# EAGLE design mesinCuciTangan (EAGLE 9.6.2)
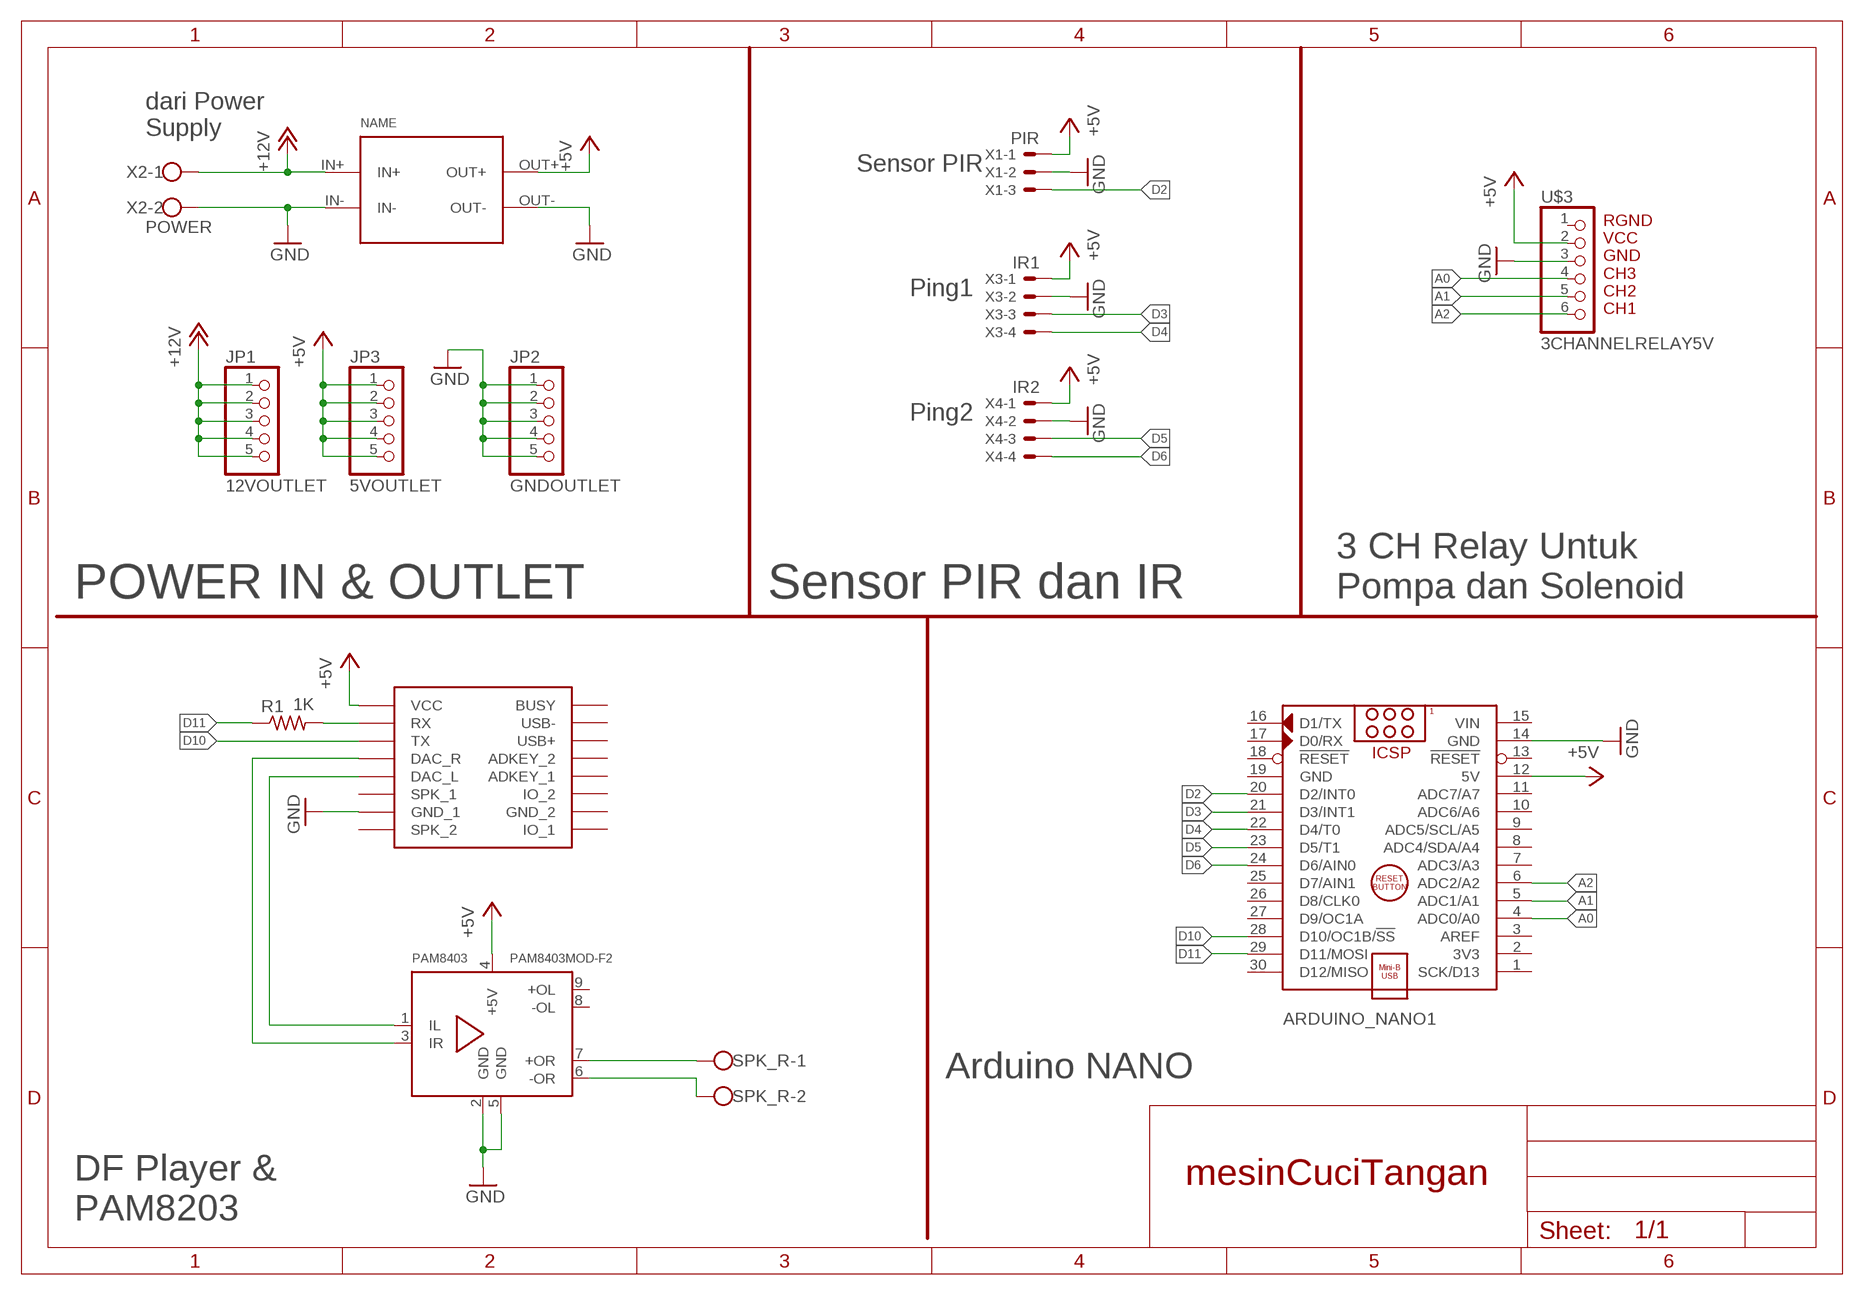
[diagram p0: schematic, sheet 1]

## Parts
ARDUINO_NANO1  ARDUINO_NANO  [ARDUINO_NANO]
JP1  12VOUTLET  PINHD-1X5  [1X05]
JP2  GNDOUTLET  PINHD-1X5  [1X05]
JP3  5VOUTLET  PINHD-1X5  [1X05]
LM2596  LM2596  CP8-ADJ  [CP8-ADJ]
PAM8403  PAM8403MOD-F2  [PAM8403MOD2]
R1  1K  R-US_0207/10  [0207/10]
SPK_R  W237-102  [W237-102]
U$2  DFPLAYER  [DFPLAYER]
U$3  3CHANNELRELAY5V  [3CHANNELRELAY]
X1  PIR  22-23-2031  [22-23-2031]
X2  POWER  W237-102  [W237-102]
X3  IR1  22-23-2041  [22-23-2041]
X4  IR2  22-23-2041  [22-23-2041]

## Nets
+5V: ARDUINO_NANO1.12(5V) JP3.1 JP3.2 JP3.3 JP3.4 JP3.5 LM2596.OUT+ PAM8403.4(+5V) U$2.VCC U$3.2 X1.1 X3.1 X4.1
+12V: JP1.1 JP1.2 JP1.3 JP1.4 JP1.5 LM2596.IN+ X2.1
A0: ARDUINO_NANO1.4(ADC0/A0) U$3.4
A1: ARDUINO_NANO1.5(ADC1/A1) U$3.5
A2: ARDUINO_NANO1.6(ADC2/A2) U$3.6
D2: ARDUINO_NANO1.20(D2/INT0) X1.3
D3: ARDUINO_NANO1.21(D3/INT1) X3.3
D4: ARDUINO_NANO1.22(D4/T0) X3.4
D5: ARDUINO_NANO1.23(D5/T1) X4.3
D6: ARDUINO_NANO1.24(D6/AIN0) X4.4
D10: ARDUINO_NANO1.28(D10/OC1B/!SS) U$2.TX
D11: ARDUINO_NANO1.29(D11/MOSI) R1.1
GND: ARDUINO_NANO1.14(GND) JP2.1 JP2.2 JP2.3 JP2.4 JP2.5 LM2596.IN- LM2596.OUT- PAM8403.2(GND) PAM8403.5(GND) U$2.GND_1 U$3.3 X1.2 X2.2 X3.2 X4.2
N$1: PAM8403.7(+OR) SPK_R.1
N$2: PAM8403.1(IL) U$2.DAC_L
N$3: PAM8403.3(IR) U$2.DAC_R
N$4: PAM8403.6(-OR) SPK_R.2
N$7: R1.2 U$2.RX
Unconnected: ARDUINO_NANO1.1(SCK/D13) ARDUINO_NANO1.2(3V3) ARDUINO_NANO1.3(AREF) ARDUINO_NANO1.7(ADC3/A3) ARDUINO_NANO1.8(ADC4/SDA/A4) ARDUINO_NANO1.9(ADC5/SCL/A5) ARDUINO_NANO1.10(ADC6/A6) ARDUINO_NANO1.11(ADC7/A7) ARDUINO_NANO1.13(!RESET) ARDUINO_NANO1.16(D1/TX) ARDUINO_NANO1.17(D0/RX) ARDUINO_NANO1.18(!RESET) ARDUINO_NANO1.25(D7/AIN1) ARDUINO_NANO1.26(D8/CLK0) ARDUINO_NANO1.27(D9/OC1A) ARDUINO_NANO1.30(D12/MISO) PAM8403.8(-OL) PAM8403.9(+OL) U$2.ADKEY1(ADKEY_1) U$2.ADKEY2(ADKEY_2) U$2.BUSY U$2.GND_2 U$2.IO1(IO_1) U$2.IO2(IO_2) U$2.SPK1(SPK_1) U$2.SPK2(SPK_2) U$2.USB+ U$2.USB- U$3.1

## Notes on the sheet
- dari Power
  Supply
- Sensor PIR
- Ping1
- Ping2
- POWER IN & OUTLET | Sensor PIR dan IR
- 3 CH Relay Untuk 
  Pompa dan Solenoid
- Arduino NANO
- DF Player &
  PAM8203

## Power pins joined to a net without a drawn wire
GND: ARDUINO_NANO1.19(GND)
VIN: ARDUINO_NANO1.15(VIN)

## Library data of the parts
ARDUINO_NANO1 = ArduinoNanoV30:ARDUINO_NANO: Arduino Nano V3.0 Module Overview: The Arduino Nano is a small, complete, and breadboard-friendly board based on the ATmega328 (Arduino Nano 3.x) or ATmega168 (Arduino Nano 2.x). It has more or less the same functionality of the Arduino Duemilanove, but in a different package. It lacks only a DC power jack, and works with a Mini-B USB cable instead of a standard one. The Nano was designed and is being produced by Gravitech <http://www.gravitech.us/arna30wiatp.html>. General specifications: Item Value Microcontroller Atmel ATmega168 or ATmega328 Operating Voltage (logic level) 5 V Input Voltage (recommended) 7-12 V Input Voltage (limits) 6-20 V Digital I/O Pins 14 (of which 6 provide PWM output) Analog Input Pins 8 DC Current per I/O Pin 40 mA Flash Memory 16 KB (ATmega168) or 32 KB (ATmega328) of which 2 KB used by bootloader SRAM 1 KB (ATmega168) or 2 KB (ATmega328) EEPROM 512 bytes (ATmega168) or 1 KB (ATmega328) Clock Speed 16 MHz Dimensions (Inches) 0.73" x 1.70" Dimensions (mm) 18mm x 45mm Overall height About 9 mm (not including pins) Weigth 5 g Power: The Arduino Nano can be powered via the Mini-B USB connection, 6-20V unregulated external power supply (pin 30), or 5V regulated external power supply (pin 27). The power source is automatically selected to the highest voltage source. Memory: The ATmega168 has 16 KB of flash memory for storing code (of which 2 KB is used for the bootloader); the ATmega328 has 32 KB, (also with 2 KB used for the bootloader). The ATmega168 has 1 KB of SRAM and 512 bytes of EEPROM (which can be read and written with the EEPROM library); the ATmega328 has 2 KB of SRAM and 1 KB of EEPROM. Input and Output: Each of the 14 digital pins on the Nano can be used as an input or output, using pinMode(), digitalWrite(), and digitalRead() functions. They operate at 5 volts. Each pin can provide or receive a maximum of 40 mA and has an internal pull-up resistor (disconnected by default) of 20-50 kOhms. In addition, some pins have specialized functions. Visit Arduino - ArduinoBoardNano <https://www.arduino.cc/en/Main/ArduinoBoardNano>
JP1-JP3 = pinhead:PINHD-1X5: PIN HEADER
LM2596 = userlib:CP8-ADJ: Voltage regulator IN: 7-35V OUT: ADJ
PAM8403 = dl9sec_public:PAM8403MOD: PAM8403 module 2x3W@4R
R1 = rcl:R-US_: RESISTOR, American symbol; SPICEPREFIX: R
SPK_R X2 = con-wago-500:W237-102: WAGO SCREW CLAMP; MPN: 237-102; OC_FARNELL: unknown; OC_NEWARK: 70K9898
U$2 = DFPlayer_v1:DFPLAYER
U$3 = mesinCuciCustomLib:3CHANNELRELAY5V
X1 = con-molex:22-23-2031: .100" (2.54mm) Center Header - 3 Pin; MF: MOLEX; MPN: 22-23-2031; OC_FARNELL: 1462950; OC_NEWARK: 30C0862
X3 X4 = con-molex:22-23-2041: .100" (2.54mm) Center Header - 4 Pin; MF: MOLEX; MPN: 22-23-2041; OC_FARNELL: 1462920; OC_NEWARK: 38C0355

## Board
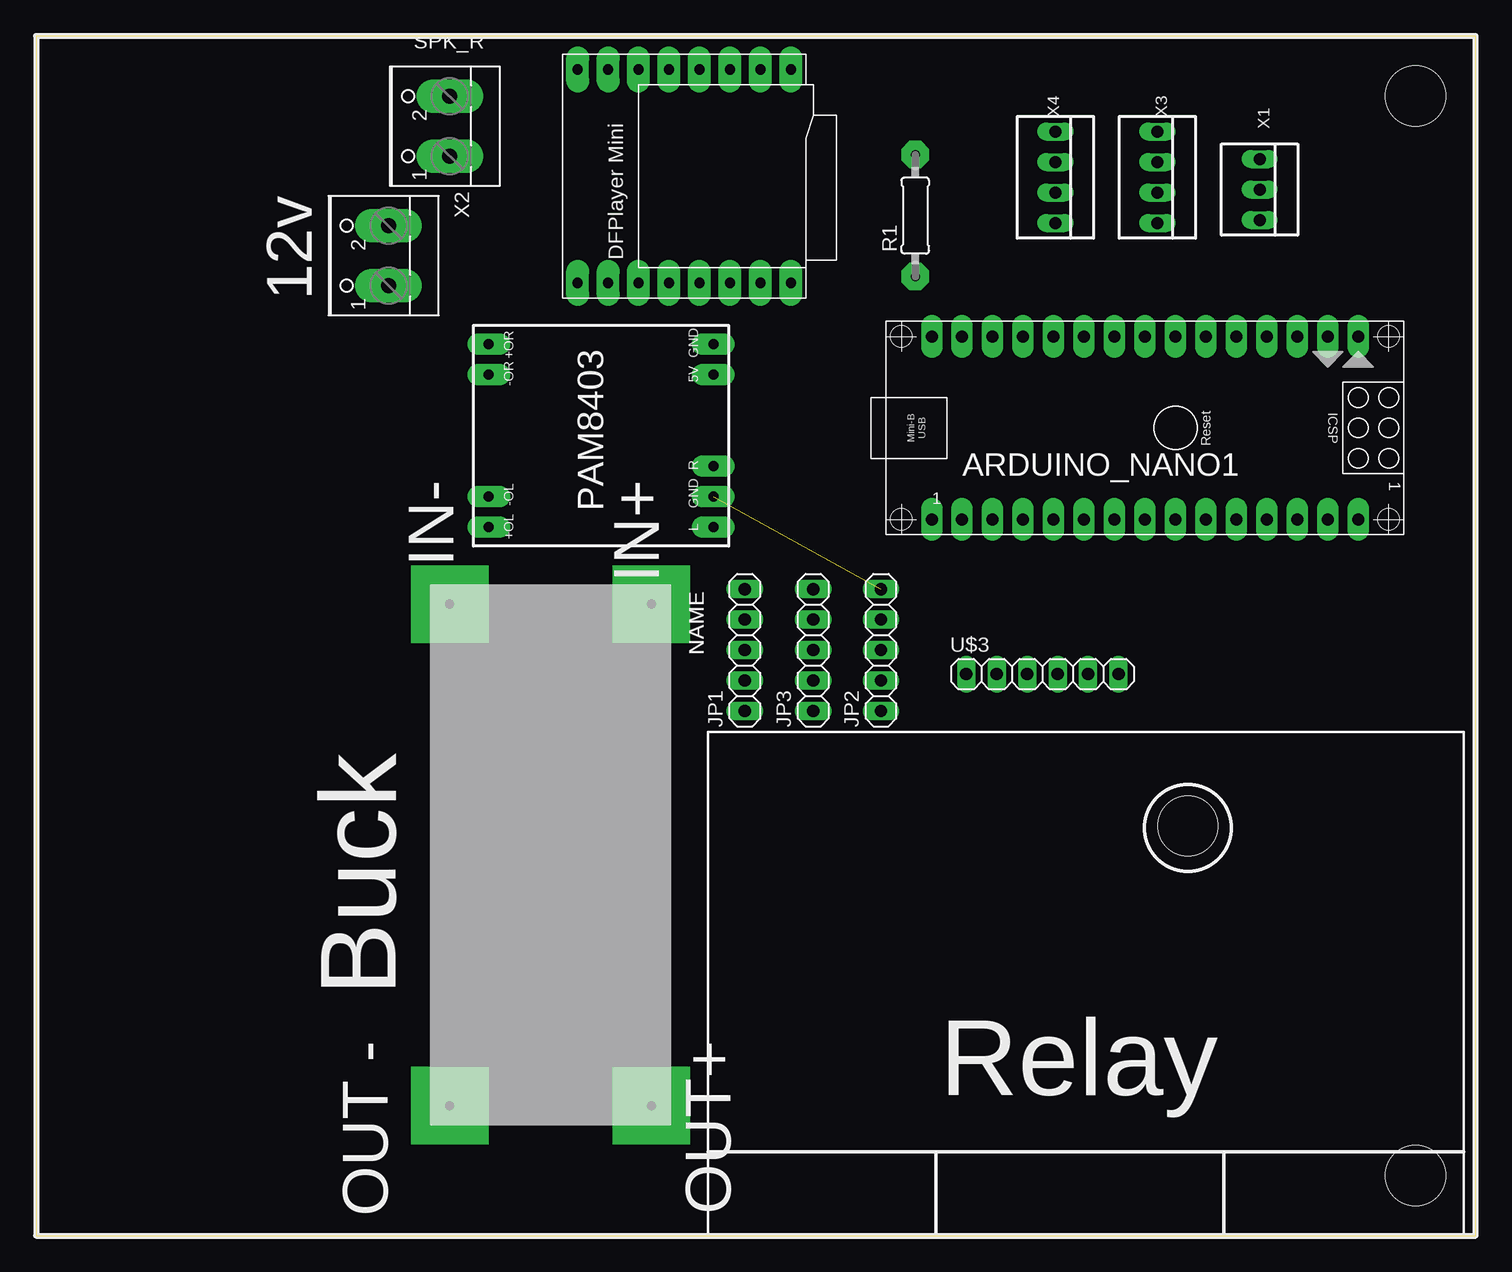
[diagram p1: board, top side]
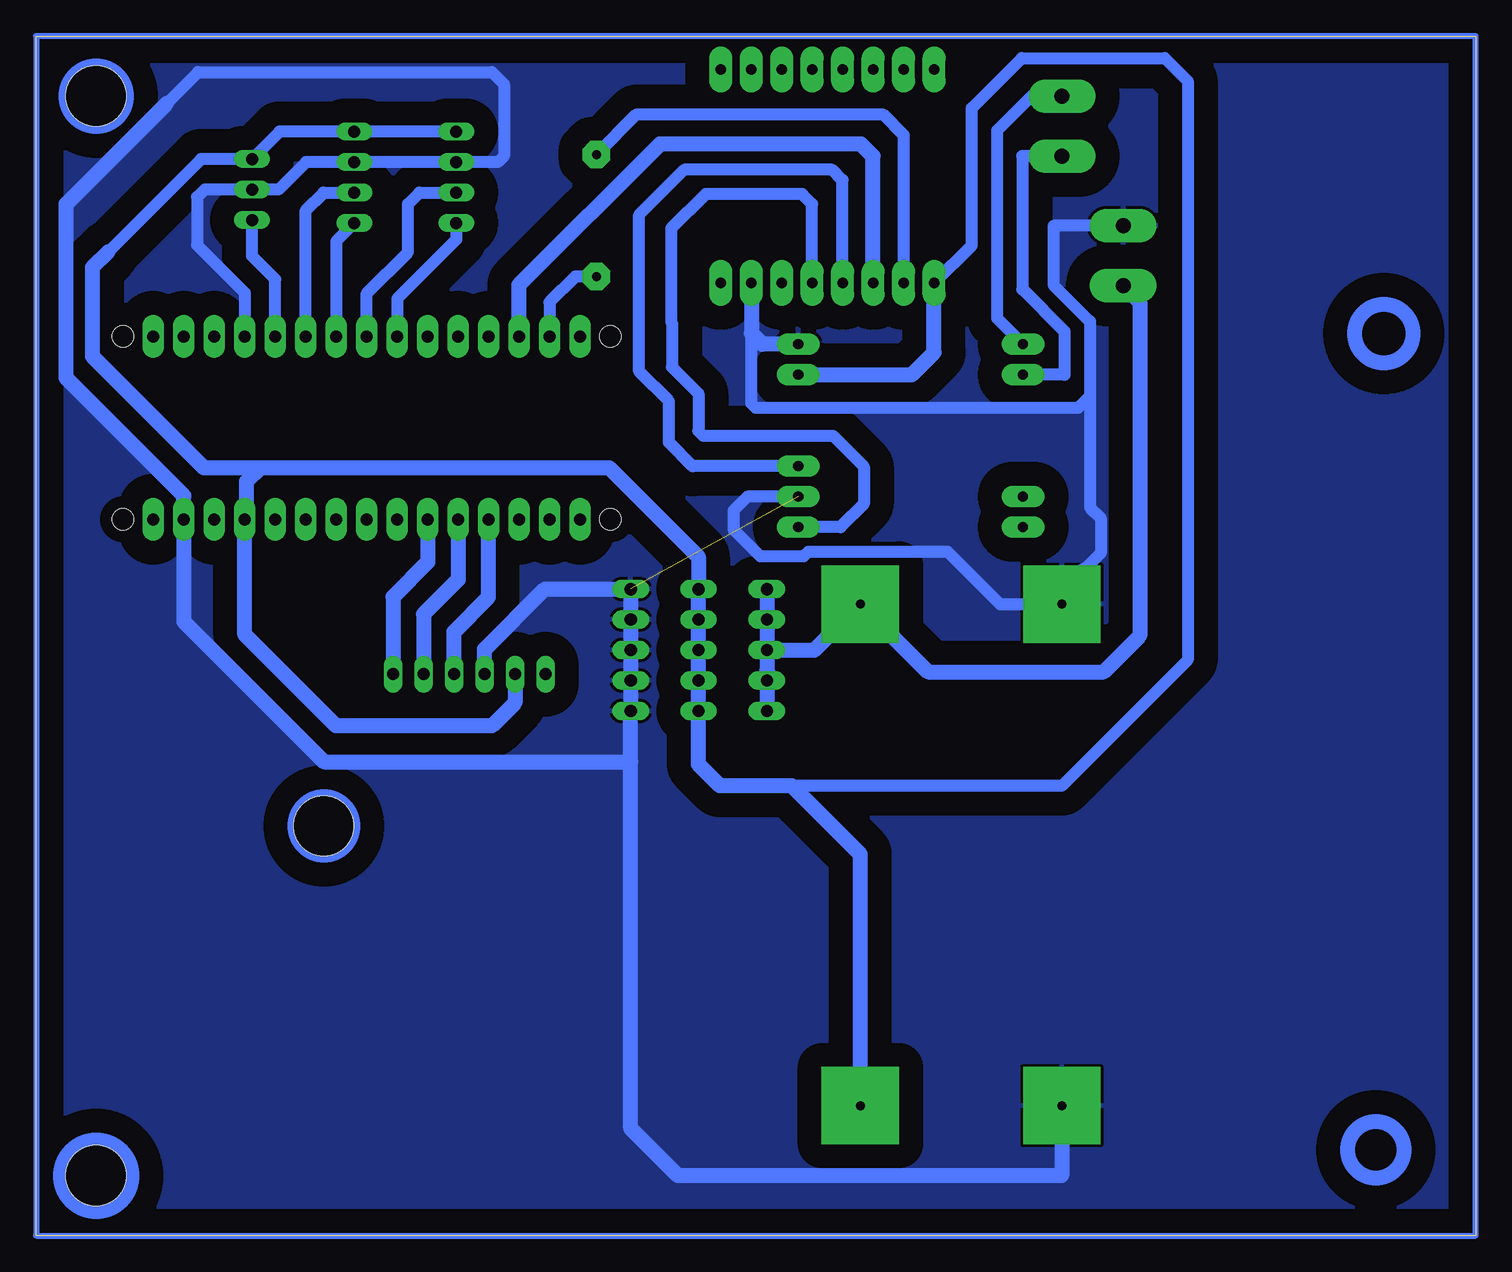
[diagram p2: board, bottom side, seen from below]

Size 120 x 100 mm. Coordinates in mm from the lower left corner, seen from the top.
Outline: 0,0 120,0 120,100 0,100 0,0
Copper layers (1*16): Top 0.035mm / dielectric 1.5mm / Bottom 0.035mm
Design rules "default *": minimum track width 6mil, minimum drill 0.35mm, track to track 2mm, track to pad 0.5mm, pad to pad 0.5mm, via to via 0.5mm, smd to smd 0.5mm, copper to edge 40mil, drill to drill 6mil, minimum pad ring 10mil, minimum via ring 8mil, stop-mask expansion 4mil, vias tented up to drill 0mil, thermal gap 10mil
Holes 5 mm at 96.02,34.16 115,95 115,5

### Footprints (pad centres in the part's own frame; a part is rotated, then mirrored left to right if it is on the bottom)
ARDUINO_NANO = drill 1 pad 1.8 long: 1 -20.32,-7.62; 2 -17.78,-7.62; 3 -15.24,-7.62; 4 -12.7,-7.62; 5 -10.16,-7.62; 6 -7.62,-7.62; 7 -5.08,-7.62; 8 -2.54,-7.62; 9 0,-7.62; 10 2.54,-7.62; 11 5.08,-7.62; 12 7.62,-7.62; 13 10.16,-7.62; 14 12.7,-7.62; 15 15.24,-7.62; 16 15.24,7.62; 17 12.7,7.62; 18 10.16,7.62; 19 7.62,7.62; 20 5.08,7.62; 21 2.54,7.62; 22 0,7.62; 23 -2.54,7.62; 24 -5.08,7.62; 25 -7.62,7.62; 26 -10.16,7.62; 27 -12.7,7.62; 28 -15.24,7.62; 29 -17.78,7.62; 30 -20.32,7.62 | hole 1.778: -22.86,-7.62; -22.86,7.62; 17.78,7.62; 17.78,-7.62
1X05 = drill 1.016 long: 1 -5.08,0; 2 -2.54,0; 3 0,0; 4 2.54,0; 5 5.08,0
CP8-ADJ = drill 0.75 pad 6.452 square: IN+ -21.81,7.05; IN- -21.81,-9.75; OUT+ 19.99,7.05; OUT- 19.99,-9.75
PAM8403MOD2 = drill 0.85 pad 1.8 long: 1 0,0; 2 2.54,0; 3 5.08,0; 4 12.7,0; 5 15.24,0; 6 15.24,18.733; 7 12.7,18.733; 8 2.54,18.733; 9 0,18.733
0207/10 = drill 0.75 pad 2.286 octagon: 1 -5.08,0; 2 5.08,0
W237-102 = drill 1.25 pad 2.8 long: 1 -2.5,-1.27; 2 2.5,-1.27
DFPLAYER = drill 0.85 pad 1.93 long: ADKEY1 8.89,-1.27; ADKEY2 8.89,1.27; BUSY 8.89,8.89; DAC_L -8.89,-1.27; DAC_R -8.89,1.27; GND_1 -8.89,-6.35; GND_2 8.89,-6.35; IO1 8.89,-8.89; IO2 8.89,-3.81; RX -8.89,6.35; SPK1 -8.89,-3.81; SPK2 -8.89,-8.89; TX -8.89,3.81; USB+ 8.89,3.81; USB- 8.89,6.35; VCC -8.89,8.89
3CHANNELRELAY = drill 1.016 long: 1 21.54,46.81; 2 24.08,46.81; 3 26.62,46.81; 4 29.16,46.81; 5 31.7,46.81; 6 34.24,46.81
22-23-2031 = drill 1 long: 1 -2.54,0; 2 0,0; 3 2.54,0
22-23-2041 = drill 1 long: 1 -3.81,0; 2 -1.27,0; 3 1.27,0; 4 3.81,0

### Placement (x,y rotation side)
ARDUINO_NANO1  94.98,67.33 0 top
JP1  59.08,48.81 90 top
JP2  70.43,48.81 90 top
JP3  64.78,48.81 90 top
LM2596  44.24,30.83 270 top
PAM8403  56.46,59.07 90 top
R1  73.29,85.04 90 top
SPK_R  33.21,92.49 90 top
U$2  54.03,88.32 90 top
U$3  56,0 0 top
X1  102,87.21 270 top
X2  28.11,81.69 90 top
X3  93.47,88.22 270 top
X4  84.97,88.22 270 top

### Tracks (layer width: path | path; a pad name or v marks a point on that pad's centre or on a via)
+5V
  Bottom 1.016: X4.1 X3.1 99.71,92.03 X1.1 106.25,89.75 114,82 | U$2.VCC 42,82.57 42,94 37.83,98.17 25.91,98.17 24,96.26 24,48 34.5,37.5 58,37.5
  Bottom 1.27: LM2596.OUT+ 51.29,31.79 57,37.5 58,37.5 63,37.5 64.78,39.28 JP3.1 JP3.2 JP3.3 JP3.4 JP3.5 64.78,56.58 72.2,64 101.34,64 | U$3.2 80.08,44.42 82,42.5 95,42.5 102.6,50.1 ARDUINO_NANO1.12 102.45,59.86 102.45,62.89 101.34,64 | 101.34,64 106,64 115.3,73.3 115.3,80.7 114,82 | PAM8403.4 47,71.77 45.14,73.63 U$2.VCC
+12V
  Bottom 1.27: JP1.3 55.12,48.81 LM2596.IN+ 45.65,47 31,47 28,50 28,77.81 X2.1 | JP1.5 JP1.4 JP1.3 | JP1.3 JP1.2 | JP1.2 59,46.35 59,47 59.08,47.08 | JP1.2 JP1.1
A0
  Bottom 1.27: U$3.4 85.16,50.34 82.28,53.22 ARDUINO_NANO1.4
A1
  Bottom 1.27: ARDUINO_NANO1.5 84.82,54.68 87.7,51.8 U$3.5
A2
  Bottom 1.27: ARDUINO_NANO1.6 87.36,56.14 90.25,53.25 U$3.6
D2
  Bottom 1.016: ARDUINO_NANO1.20 100.06,79.73 102,81.67 X1.3
D3
  Bottom 1.016: ARDUINO_NANO1.21 97.52,85.48 96.05,86.95 X3.3
D4
  Bottom 1.016: X3.4 94.98,82.9 ARDUINO_NANO1.22
D5
  Bottom 1.016: ARDUINO_NANO1.23 92.44,78.56 89,82 89,86 88.04,86.95 X4.3
D6
  Bottom 1.016: X4.4 84.97,83.03 89.9,78.1 ARDUINO_NANO1.24
D10
  Bottom 1.27: ARDUINO_NANO1.28 79.74,79.26 68,91 51.22,91 50.22,90 U$2.TX
D11
  Bottom 1.016: R1.1 75.04,79.96 77.2,77.8 ARDUINO_NANO1.29
GND  (1 unrouted)
  Bottom 1.016: ARDUINO_NANO1.19 102.6,78.6 106.57,82.57 106.57,86.57 105.94,87.21 X1.2 99.79,87.21 97.51,89.49 X3.2 X4.2 81.5,89.5 81,90 81,96 82,97 106.5,97 109.12,94.38 | PAM8403.2 60.7,61.61 61.85,60.45 61.85,58.85 59.64,56.64 56.01,56.64 55.63,57.02 44.02,57.02 39.64,52.64 LM2596.IN- | X2.2 35.18,84.19 35.18,79.25 32.14,76.2 32.14,70 | 34.06,54.06 31.25,56.88 31.25,59.82 32.14,60.71 32.14,70 | 32.14,70 33.14,69 60,69 60.38,69.38 60.38,75.23
  Bottom 1.27: LM2596.IN- 34.06,53.06 34.06,54.06 32.61,55.52 | LM2596.OUT- 34.49,5 66.5,5 70.43,8.93 70.43,39.5 | 70.43,39.5 JP2.1 JP2.2 JP2.3 JP2.4 JP2.5 77.61,53.89 82.62,48.88 U$3.3 | 70.43,39.5 96,39.5 107.68,51.18 ARDUINO_NANO1.14 107.68,61.68 117.5,71.5 117.5,86 109.12,94.38 | PAM8403.5 59.46,74.31 60.38,75.23 U$2.GND_1
  pour Bottom: 0,0 120,0 120,100 0,100 0,1
N$1
  Bottom 1.016: SPK_R.1 37.79,89.99 37.79,78.89 34.27,75.36 34.27,71.77 PAM8403.7
N$2
  Bottom 1.016: U$2.DAC_L 55.3,86 56.14,86.84 64.16,86.84 67.05,83.95 67.05,76.16 67,76.11 67,72.42 64.79,70.21 64.79,67.07 64.39,66.67 53.58,66.67 51,64.09 51,61 52.93,59.07 PAM8403.1
N$3
  Bottom 1.016: U$2.DAC_R 52.76,88 53.62,88.86 65.97,88.86 69.73,85.1 69.73,72.04 67.25,69.56 67.25,66.14 65.26,64.15 PAM8403.3
N$4
  Bottom 1.016: PAM8403.6 39.89,76.47 39.89,92.11 37.01,94.99 SPK_R.2
N$7
  Bottom 1.016: R1.2 69.93,93.47 49.41,93.47 47.68,91.74 U$2.RX
N$8
  Bottom 0.508: 0,0 0,100 120,100 120,0 0,0
(copper drawn outside any net)
  shapes: Bottom circle x5

### Text on the board
tPlace: 12v | IN- / / / IN+ | Buck | OUT - / / / / / OUT+ | Relay